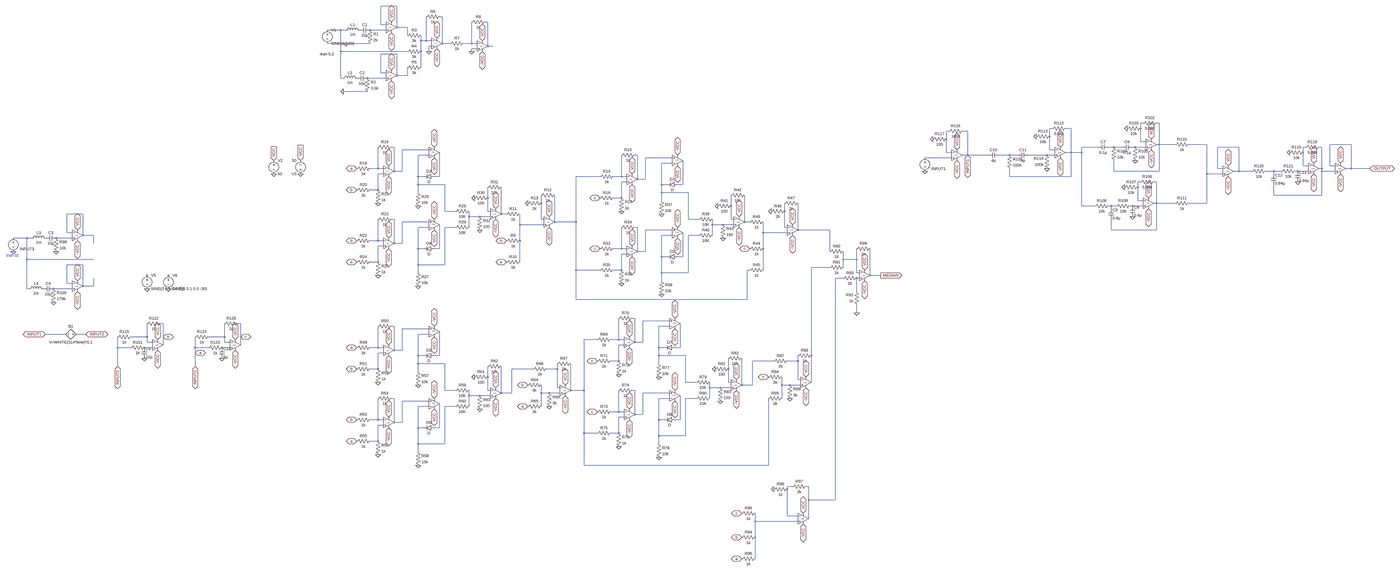
[diagram p0: schematic Median Filter.asc, whole sheet]
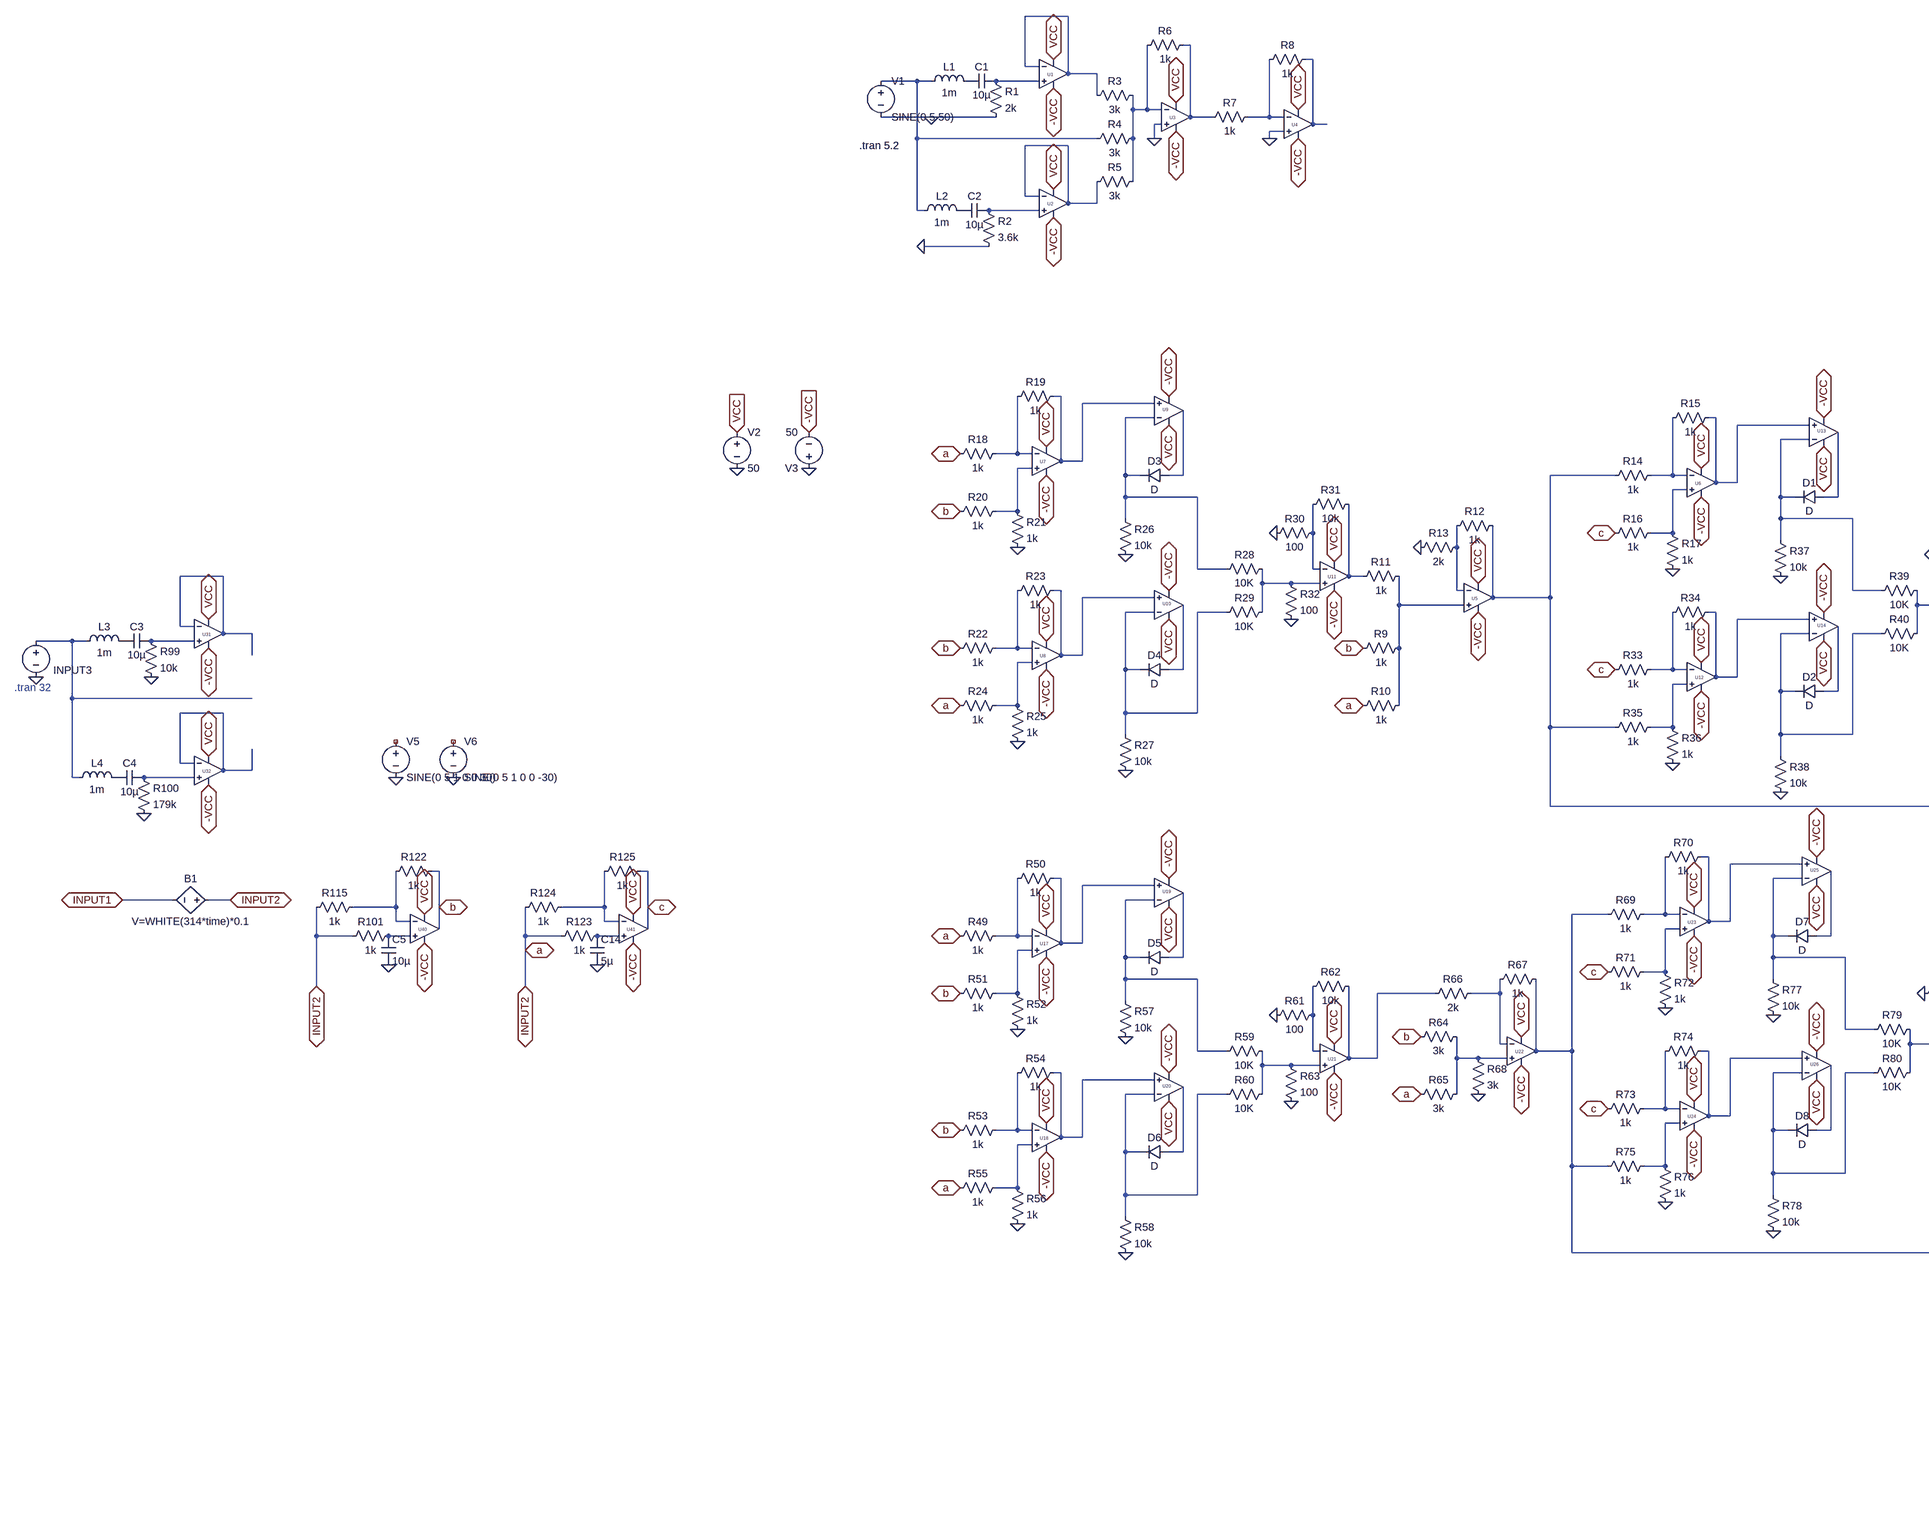
[diagram p1: schematic Median Filter.asc, part, row 1 of 1, column 1 of 2]
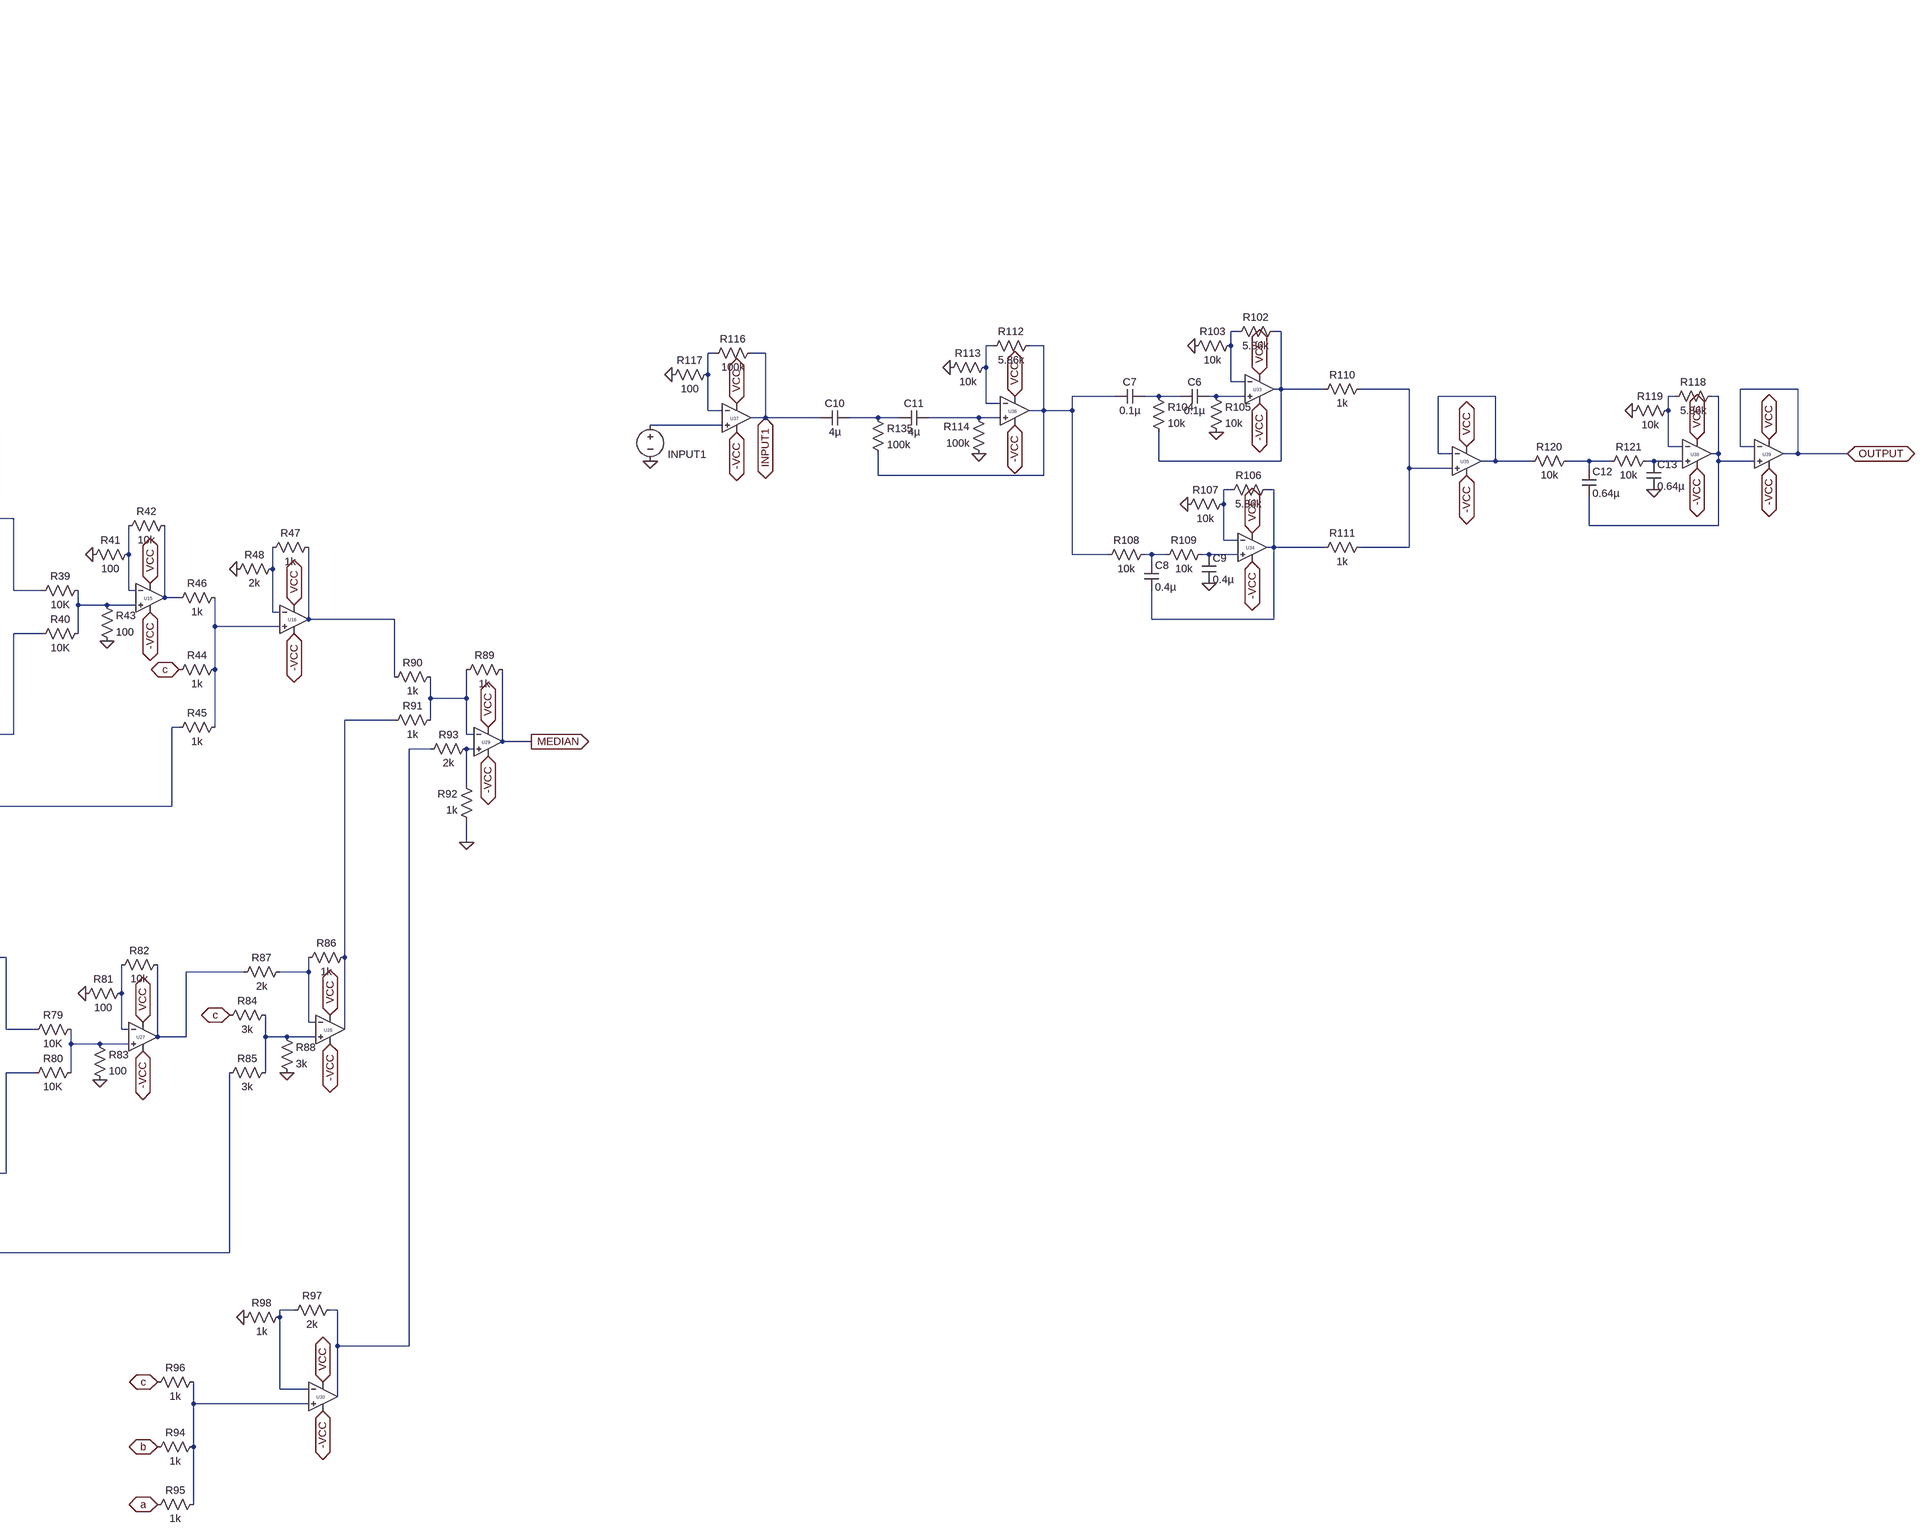
[diagram p2: schematic Median Filter.asc, part, row 1 of 1, column 2 of 2]
Median Filter.asc, the LTspice schematic file:
Version 4
SHEET 1 6620 3560
WIRE 464 -16 368 -16
WIRE 736 48 720 48
WIRE 1008 80 992 80
WIRE 368 96 368 -16
WIRE 400 96 368 96
WIRE 464 112 464 -16
WIRE 528 112 464 112
WIRE 128 128 48 128
WIRE 160 128 128 128
WIRE 400 128 304 128
WIRE 528 160 528 112
WIRE 608 192 608 160
WIRE 640 192 640 48
WIRE 640 192 608 192
WIRE 672 192 640 192
WIRE 160 208 48 208
WIRE 304 208 160 208
WIRE 736 208 736 48
WIRE 784 208 736 208
WIRE 912 208 912 80
WIRE 912 208 864 208
WIRE 944 208 912 208
WIRE 672 224 656 224
WIRE 1008 224 1008 80
WIRE 1040 224 1008 224
WIRE 944 240 912 240
WIRE 128 256 128 128
WIRE 528 256 128 256
WIRE 608 256 608 192
WIRE 656 256 656 224
WIRE 912 256 912 240
WIRE 464 272 368 272
WIRE 608 352 608 256
WIRE 368 384 368 272
WIRE 400 384 368 384
WIRE 464 400 464 272
WIRE 528 400 528 352
WIRE 528 400 464 400
WIRE 128 416 128 256
WIRE 144 416 128 416
WIRE 400 416 288 416
WIRE 288 496 144 496
WIRE 5040 880 5024 880
WIRE 5136 880 5120 880
WIRE 4496 912 4480 912
WIRE 4608 912 4576 912
WIRE 5024 912 5024 880
WIRE 3856 928 3840 928
WIRE 3968 928 3936 928
WIRE 4480 960 4480 912
WIRE 3840 976 3840 928
WIRE 5024 992 5024 912
WIRE 5056 992 5024 992
WIRE 5136 1008 5136 880
WIRE 5136 1008 5120 1008
WIRE 5232 1008 5136 1008
WIRE 5424 1008 5312 1008
WIRE 6288 1008 6160 1008
WIRE 448 1024 432 1024
WIRE 4768 1024 4672 1024
WIRE 4864 1024 4832 1024
WIRE 4912 1024 4864 1024
WIRE 4992 1024 4976 1024
WIRE 5056 1024 4992 1024
WIRE 5616 1024 5488 1024
WIRE 6016 1024 6000 1024
WIRE 6112 1024 6096 1024
WIRE 656 1040 496 1040
WIRE 4480 1040 4480 960
WIRE 4512 1040 4480 1040
WIRE 3840 1056 3840 976
WIRE 3872 1056 3840 1056
WIRE 4608 1056 4608 912
WIRE 4608 1056 4576 1056
WIRE 4672 1056 4672 1024
WIRE 4672 1056 4608 1056
WIRE 6000 1056 6000 1024
WIRE 656 1072 592 1072
WIRE 1904 1072 1888 1072
WIRE 3968 1072 3968 928
WIRE 3968 1072 3936 1072
WIRE 4112 1072 3968 1072
WIRE 4240 1072 4176 1072
WIRE 4288 1072 4240 1072
WIRE 4464 1072 4352 1072
WIRE 4512 1072 4464 1072
WIRE 2112 1088 1952 1088
WIRE 3872 1088 3712 1088
WIRE 2112 1120 2048 1120
WIRE 6000 1136 6000 1056
WIRE 6032 1136 6000 1136
WIRE 6160 1136 6160 1008
WIRE 6192 1136 6160 1136
WIRE 352 1152 352 1024
WIRE 352 1152 304 1152
WIRE 384 1152 352 1152
WIRE 5488 1152 5488 1024
WIRE 5520 1152 5488 1152
WIRE 6112 1152 6112 1024
WIRE 6112 1152 6096 1152
WIRE 6288 1152 6288 1008
WIRE 6288 1152 6256 1152
WIRE 6432 1152 6288 1152
WIRE 448 1168 448 1024
WIRE 496 1168 496 1040
WIRE 496 1168 448 1168
WIRE 4864 1168 4864 1104
WIRE 5136 1168 5136 1008
WIRE 5136 1168 4864 1168
WIRE 5616 1168 5616 1024
WIRE 5616 1168 5584 1168
WIRE 5696 1168 5616 1168
WIRE 5824 1168 5776 1168
WIRE 5872 1168 5824 1168
WIRE 5968 1168 5952 1168
WIRE 6032 1168 5968 1168
WIRE 6112 1168 6112 1152
WIRE 6192 1168 6112 1168
WIRE 384 1184 352 1184
WIRE 5424 1184 5424 1008
WIRE 5520 1184 5424 1184
WIRE 5824 1184 5824 1168
WIRE 592 1200 592 1072
WIRE 624 1200 592 1200
WIRE 720 1200 720 1056
WIRE 720 1200 688 1200
WIRE 1680 1200 1536 1200
WIRE 1808 1200 1808 1072
WIRE 1808 1200 1760 1200
WIRE 1840 1200 1808 1200
WIRE 4240 1200 4240 1152
WIRE 4608 1200 4608 1056
WIRE 4608 1200 4240 1200
WIRE 1904 1216 1904 1072
WIRE 1952 1216 1952 1088
WIRE 1952 1216 1904 1216
WIRE 1840 1232 1808 1232
WIRE 5024 1232 5008 1232
WIRE 5120 1232 5104 1232
WIRE 592 1248 592 1200
WIRE 752 1248 592 1248
WIRE 2048 1248 2048 1120
WIRE 2080 1248 2048 1248
WIRE 2176 1248 2176 1104
WIRE 2176 1248 2144 1248
WIRE 5008 1264 5008 1232
WIRE 352 1280 352 1184
WIRE 352 1280 304 1280
WIRE 592 1296 592 1248
WIRE 2048 1296 2048 1248
WIRE 2208 1296 2048 1296
WIRE 5824 1312 5824 1248
WIRE 6112 1312 6112 1168
WIRE 6112 1312 5824 1312
WIRE 1008 1328 1008 1264
WIRE 1808 1328 1808 1232
WIRE 1808 1328 1760 1328
WIRE 2048 1344 2048 1296
WIRE 5008 1344 5008 1264
WIRE 5040 1344 5008 1344
WIRE 1328 1360 1328 1312
WIRE 5120 1360 5120 1232
WIRE 5120 1360 5104 1360
WIRE 5232 1360 5120 1360
WIRE 5424 1360 5424 1184
WIRE 5424 1360 5312 1360
WIRE 2464 1376 2464 1312
WIRE 4672 1376 4672 1056
WIRE 4752 1376 4672 1376
WIRE 4848 1376 4832 1376
WIRE 4880 1376 4848 1376
WIRE 4976 1376 4960 1376
WIRE 5040 1376 4976 1376
WIRE 4848 1392 4848 1376
WIRE 752 1408 752 1248
WIRE 816 1408 752 1408
WIRE 1008 1408 1008 1328
WIRE 1024 1408 1008 1408
WIRE 2784 1408 2784 1360
WIRE -1616 1424 -1712 1424
WIRE 1088 1424 1088 1264
WIRE 1120 1424 1088 1424
WIRE 896 1440 896 1408
WIRE 960 1440 896 1440
WIRE 1024 1440 960 1440
WIRE 448 1456 432 1456
WIRE 1328 1456 1328 1360
WIRE 1344 1456 1328 1456
WIRE 2208 1456 2208 1296
WIRE 2272 1456 2208 1456
WIRE 2464 1456 2464 1376
WIRE 2480 1456 2464 1456
WIRE 656 1472 496 1472
WIRE 1408 1472 1408 1312
WIRE 1536 1472 1536 1200
WIRE 1536 1472 1408 1472
WIRE 2544 1472 2544 1312
WIRE 2576 1472 2544 1472
WIRE 1200 1488 1200 1424
WIRE 1344 1488 1200 1488
WIRE 2352 1488 2352 1456
WIRE 2416 1488 2352 1488
WIRE 2480 1488 2416 1488
WIRE 656 1504 592 1504
WIRE 816 1504 752 1504
WIRE 896 1504 896 1440
WIRE 1904 1504 1888 1504
WIRE 2784 1504 2784 1408
WIRE 2800 1504 2784 1504
WIRE 2112 1520 1952 1520
WIRE 2864 1520 2864 1360
WIRE 3072 1520 2864 1520
WIRE 4848 1520 4848 1456
WIRE 5120 1520 5120 1360
WIRE 5120 1520 4848 1520
WIRE -1712 1536 -1712 1424
WIRE -1680 1536 -1712 1536
WIRE 2656 1536 2656 1472
WIRE 2800 1536 2656 1536
WIRE -1616 1552 -1616 1424
WIRE -1552 1552 -1616 1552
WIRE 2112 1552 2048 1552
WIRE 2272 1552 2208 1552
WIRE 2352 1552 2352 1488
WIRE -1952 1568 -2032 1568
WIRE -1920 1568 -1952 1568
WIRE -1680 1568 -1776 1568
WIRE 352 1584 352 1456
WIRE 352 1584 304 1584
WIRE 384 1584 352 1584
WIRE 1200 1584 1200 1488
WIRE -1552 1600 -1552 1552
WIRE 448 1600 448 1456
WIRE 496 1600 496 1472
WIRE 496 1600 448 1600
WIRE 384 1616 352 1616
WIRE 592 1632 592 1504
WIRE 624 1632 592 1632
WIRE 720 1632 720 1488
WIRE 720 1632 688 1632
WIRE 1808 1632 1808 1504
WIRE 1808 1632 1760 1632
WIRE 1840 1632 1808 1632
WIRE 2656 1632 2656 1536
WIRE 1904 1648 1904 1504
WIRE 1952 1648 1952 1520
WIRE 1952 1648 1904 1648
WIRE 3072 1648 3072 1520
WIRE 1840 1664 1808 1664
WIRE 2048 1680 2048 1552
WIRE 2080 1680 2048 1680
WIRE 2176 1680 2176 1536
WIRE 2176 1680 2144 1680
WIRE -1952 1696 -1952 1568
WIRE -1552 1696 -1952 1696
WIRE 3152 1696 3152 1648
WIRE 3232 1696 3232 1632
WIRE 3232 1696 3152 1696
WIRE 352 1712 352 1616
WIRE 352 1712 304 1712
WIRE 1200 1712 1200 1584
WIRE -1616 1728 -1712 1728
WIRE 592 1728 592 1632
WIRE 752 1728 752 1504
WIRE 752 1728 592 1728
WIRE 3072 1744 2944 1744
WIRE 3152 1744 3152 1696
WIRE 1536 1760 1536 1472
WIRE 1680 1760 1536 1760
WIRE 1808 1760 1808 1664
WIRE 1808 1760 1760 1760
WIRE 2576 1760 2560 1760
WIRE 2656 1760 2656 1632
WIRE 592 1776 592 1728
WIRE 2048 1776 2048 1680
WIRE 2208 1776 2208 1552
WIRE 2208 1776 2048 1776
WIRE 3232 1776 3232 1696
WIRE 3248 1776 3232 1776
WIRE 3312 1792 3312 1632
WIRE 3376 1792 3312 1792
WIRE 3152 1808 3104 1808
WIRE 3248 1808 3232 1808
WIRE 2048 1824 2048 1776
WIRE -1712 1840 -1712 1728
WIRE -1680 1840 -1712 1840
WIRE -1616 1856 -1616 1728
WIRE -1552 1856 -1552 1808
WIRE -1552 1856 -1616 1856
WIRE -1952 1872 -1952 1696
WIRE -1936 1872 -1952 1872
WIRE -1680 1872 -1792 1872
WIRE 3232 1888 3232 1808
WIRE 1536 1936 1536 1760
WIRE 2560 1936 2560 1760
WIRE 2560 1936 1536 1936
WIRE 3232 2016 3232 1968
WIRE 1888 2048 1872 2048
WIRE 2096 2064 1936 2064
WIRE -1136 2080 -1152 2080
WIRE -672 2080 -688 2080
WIRE 448 2096 432 2096
WIRE 2096 2096 2032 2096
WIRE 656 2112 496 2112
WIRE -1728 2144 -1840 2144
WIRE -1600 2144 -1648 2144
WIRE 656 2144 592 2144
WIRE -1232 2160 -1232 2080
WIRE -1232 2160 -1328 2160
WIRE -1136 2160 -1136 2080
WIRE -768 2160 -768 2080
WIRE -768 2160 -864 2160
WIRE -672 2160 -672 2080
WIRE 1664 2176 1584 2176
WIRE 1792 2176 1792 2048
WIRE 1792 2176 1744 2176
WIRE 1824 2176 1792 2176
WIRE -1232 2192 -1232 2160
WIRE -1200 2192 -1232 2192
WIRE -768 2192 -768 2160
WIRE -736 2192 -768 2192
WIRE 1888 2192 1888 2048
WIRE 1936 2192 1936 2064
WIRE 1936 2192 1888 2192
WIRE -1136 2208 -1136 2160
WIRE -672 2208 -672 2160
WIRE 1824 2208 1792 2208
WIRE -1408 2224 -1408 2160
WIRE -1328 2224 -1408 2224
WIRE -1200 2224 -1248 2224
WIRE -944 2224 -944 2160
WIRE -864 2224 -944 2224
WIRE -736 2224 -784 2224
WIRE 352 2224 352 2096
WIRE 352 2224 304 2224
WIRE 384 2224 352 2224
WIRE 2032 2224 2032 2096
WIRE 2064 2224 2032 2224
WIRE 2160 2224 2160 2080
WIRE 2160 2224 2128 2224
WIRE 448 2240 448 2096
WIRE 496 2240 496 2112
WIRE 496 2240 448 2240
WIRE -944 2256 -944 2224
WIRE 384 2256 352 2256
WIRE 592 2272 592 2144
WIRE 624 2272 592 2272
WIRE 720 2272 720 2128
WIRE 720 2272 688 2272
WIRE 2032 2272 2032 2224
WIRE 2192 2272 2032 2272
WIRE 2944 2272 2944 1744
WIRE 1792 2304 1792 2208
WIRE 1792 2304 1744 2304
WIRE 2720 2304 2592 2304
WIRE 2864 2304 2864 2272
WIRE 2864 2304 2800 2304
WIRE 592 2320 592 2272
WIRE 752 2320 592 2320
WIRE 2032 2320 2032 2272
WIRE -1408 2336 -1408 2224
WIRE -944 2336 -944 2256
WIRE 352 2352 352 2256
WIRE 352 2352 304 2352
WIRE 1280 2352 1152 2352
WIRE 1424 2352 1424 2320
WIRE 1424 2352 1360 2352
WIRE 2448 2352 2448 2288
WIRE 592 2368 592 2320
WIRE 1008 2400 1008 2336
WIRE 2864 2416 2864 2304
WIRE 2880 2416 2864 2416
WIRE 2192 2432 2192 2272
WIRE 2256 2432 2192 2432
WIRE 2448 2432 2448 2352
WIRE 2464 2432 2448 2432
WIRE 2944 2432 2944 2272
WIRE 2528 2448 2528 2288
WIRE 2592 2448 2592 2304
WIRE 2592 2448 2528 2448
WIRE 2768 2448 2768 2400
WIRE 2816 2448 2768 2448
WIRE 2880 2448 2816 2448
WIRE 1424 2464 1424 2352
WIRE 1440 2464 1424 2464
WIRE 2336 2464 2336 2432
WIRE 2400 2464 2336 2464
WIRE 2464 2464 2400 2464
WIRE 752 2480 752 2320
WIRE 816 2480 752 2480
WIRE 1008 2480 1008 2400
WIRE 1024 2480 1008 2480
WIRE 1504 2480 1504 2320
WIRE 1584 2480 1584 2176
WIRE 1584 2480 1504 2480
WIRE 1888 2480 1872 2480
WIRE 1088 2496 1088 2336
WIRE 1152 2496 1152 2352
WIRE 1152 2496 1088 2496
WIRE 1328 2496 1328 2448
WIRE 1376 2496 1328 2496
WIRE 1440 2496 1376 2496
WIRE 2096 2496 1936 2496
WIRE 896 2512 896 2480
WIRE 960 2512 896 2512
WIRE 1024 2512 960 2512
WIRE 448 2528 432 2528
WIRE 2096 2528 2032 2528
WIRE 2256 2528 2192 2528
WIRE 2336 2528 2336 2464
WIRE 2768 2528 2768 2448
WIRE 656 2544 496 2544
WIRE 656 2576 592 2576
WIRE 816 2576 752 2576
WIRE 896 2576 896 2512
WIRE 1328 2576 1328 2496
WIRE 1792 2608 1792 2480
WIRE 1792 2608 1744 2608
WIRE 1824 2608 1792 2608
WIRE 1888 2624 1888 2480
WIRE 1936 2624 1936 2496
WIRE 1936 2624 1888 2624
WIRE 1824 2640 1792 2640
WIRE 352 2656 352 2528
WIRE 352 2656 304 2656
WIRE 384 2656 352 2656
WIRE 2032 2656 2032 2528
WIRE 2064 2656 2032 2656
WIRE 2160 2656 2160 2512
WIRE 2160 2656 2128 2656
WIRE 448 2672 448 2528
WIRE 496 2672 496 2544
WIRE 496 2672 448 2672
WIRE 384 2688 352 2688
WIRE 592 2704 592 2576
WIRE 624 2704 592 2704
WIRE 720 2704 720 2560
WIRE 720 2704 688 2704
WIRE 1584 2736 1584 2480
WIRE 1664 2736 1584 2736
WIRE 1792 2736 1792 2640
WIRE 1792 2736 1744 2736
WIRE 2032 2752 2032 2656
WIRE 2192 2752 2192 2528
WIRE 2192 2752 2032 2752
WIRE 352 2784 352 2688
WIRE 352 2784 304 2784
WIRE 592 2800 592 2704
WIRE 752 2800 752 2576
WIRE 752 2800 592 2800
WIRE 2032 2800 2032 2752
WIRE 592 2848 592 2800
WIRE 1584 2928 1584 2736
WIRE 2688 2928 2688 2528
WIRE 2688 2928 1584 2928
WIRE 2832 3056 2800 3056
WIRE 2928 3056 2912 3056
WIRE 2800 3072 2800 3056
WIRE 2928 3136 2928 3056
WIRE 3104 3136 3104 1808
WIRE 3104 3136 2928 3136
WIRE 2800 3232 2800 3072
WIRE 2864 3232 2800 3232
WIRE 2928 3248 2928 3136
WIRE 2608 3264 2608 3216
WIRE 2864 3264 2608 3264
WIRE 2608 3360 2608 3264
WIRE 2608 3488 2608 3360
FLAG 160 208 0
FLAG 144 496 0
FLAG 432 80 VCC
IOPIN 432 80 BiDir
FLAG 432 144 -VCC
IOPIN 432 144 BiDir
FLAG -272 1184 0
FLAG -112 1184 0
FLAG -272 1104 VCC
IOPIN -272 1104 In
FLAG -112 1104 -VCC
IOPIN -112 1104 In
FLAG 432 368 VCC
IOPIN 432 368 BiDir
FLAG 432 432 -VCC
IOPIN 432 432 BiDir
FLAG 704 176 VCC
IOPIN 704 176 BiDir
FLAG 704 240 -VCC
IOPIN 704 240 BiDir
FLAG 656 256 0
FLAG 976 192 VCC
IOPIN 976 192 BiDir
FLAG 976 256 -VCC
IOPIN 976 256 BiDir
FLAG 912 256 0
FLAG -1232 1872 0
FLAG 416 1136 VCC
IOPIN 416 1136 BiDir
FLAG 416 1200 -VCC
IOPIN 416 1200 BiDir
FLAG 352 1360 0
FLAG 416 1568 VCC
IOPIN 416 1568 BiDir
FLAG 416 1632 -VCC
IOPIN 416 1632 BiDir
FLAG 352 1792 0
FLAG 224 1152 a
IOPIN 224 1152 BiDir
FLAG 224 1712 a
IOPIN 224 1712 BiDir
FLAG 224 1280 b
IOPIN 224 1280 BiDir
FLAG 224 1584 b
IOPIN 224 1584 BiDir
FLAG 688 1088 VCC
IOPIN 688 1088 BiDir
FLAG 688 1024 -VCC
IOPIN 688 1024 BiDir
FLAG 592 1376 0
FLAG 688 1520 VCC
IOPIN 688 1520 BiDir
FLAG 688 1456 -VCC
IOPIN 688 1456 BiDir
FLAG 592 1856 0
FLAG 1056 1392 VCC
IOPIN 1056 1392 BiDir
FLAG 1056 1456 -VCC
IOPIN 1056 1456 BiDir
FLAG 928 1328 0
FLAG 960 1520 0
FLAG 1120 1712 a
IOPIN 1120 1712 BiDir
FLAG 1120 1584 b
IOPIN 1120 1584 BiDir
FLAG 1376 1440 VCC
IOPIN 1376 1440 BiDir
FLAG 1376 1504 -VCC
IOPIN 1376 1504 BiDir
FLAG 1248 1360 0
FLAG 1872 1184 VCC
IOPIN 1872 1184 BiDir
FLAG 1872 1248 -VCC
IOPIN 1872 1248 BiDir
FLAG 1808 1408 0
FLAG 1872 1616 VCC
IOPIN 1872 1616 BiDir
FLAG 1872 1680 -VCC
IOPIN 1872 1680 BiDir
FLAG 1808 1840 0
FLAG 1680 1328 c
IOPIN 1680 1328 BiDir
FLAG 1680 1632 c
IOPIN 1680 1632 BiDir
FLAG 2144 1136 VCC
IOPIN 2144 1136 BiDir
FLAG 2144 1072 -VCC
IOPIN 2144 1072 BiDir
FLAG 2048 1424 0
FLAG 2144 1568 VCC
IOPIN 2144 1568 BiDir
FLAG 2144 1504 -VCC
IOPIN 2144 1504 BiDir
FLAG 2048 1904 0
FLAG 2512 1440 VCC
IOPIN 2512 1440 BiDir
FLAG 2512 1504 -VCC
IOPIN 2512 1504 BiDir
FLAG 2384 1376 0
FLAG 2416 1568 0
FLAG 2576 1632 c
IOPIN 2576 1632 BiDir
FLAG 2832 1488 VCC
IOPIN 2832 1488 BiDir
FLAG 2832 1552 -VCC
IOPIN 2832 1552 BiDir
FLAG 2704 1408 0
FLAG 416 2208 VCC
IOPIN 416 2208 BiDir
FLAG 416 2272 -VCC
IOPIN 416 2272 BiDir
FLAG 352 2432 0
FLAG 416 2640 VCC
IOPIN 416 2640 BiDir
FLAG 416 2704 -VCC
IOPIN 416 2704 BiDir
FLAG 352 2864 0
FLAG 224 2224 a
IOPIN 224 2224 BiDir
FLAG 224 2784 a
IOPIN 224 2784 BiDir
FLAG 224 2352 b
IOPIN 224 2352 BiDir
FLAG 224 2656 b
IOPIN 224 2656 BiDir
FLAG 688 2160 VCC
IOPIN 688 2160 BiDir
FLAG 688 2096 -VCC
IOPIN 688 2096 BiDir
FLAG 592 2448 0
FLAG 688 2592 VCC
IOPIN 688 2592 BiDir
FLAG 688 2528 -VCC
IOPIN 688 2528 BiDir
FLAG 592 2928 0
FLAG 1056 2464 VCC
IOPIN 1056 2464 BiDir
FLAG 1056 2528 -VCC
IOPIN 1056 2528 BiDir
FLAG 928 2400 0
FLAG 960 2592 0
FLAG 1248 2576 a
IOPIN 1248 2576 BiDir
FLAG 1248 2448 b
IOPIN 1248 2448 BiDir
FLAG 1472 2448 VCC
IOPIN 1472 2448 BiDir
FLAG 1472 2512 -VCC
IOPIN 1472 2512 BiDir
FLAG 1376 2576 0
FLAG 1856 2160 VCC
IOPIN 1856 2160 BiDir
FLAG 1856 2224 -VCC
IOPIN 1856 2224 BiDir
FLAG 1792 2384 0
FLAG 1856 2592 VCC
IOPIN 1856 2592 BiDir
FLAG 1856 2656 -VCC
IOPIN 1856 2656 BiDir
FLAG 1792 2816 0
FLAG 1664 2304 c
IOPIN 1664 2304 BiDir
FLAG 1664 2608 c
IOPIN 1664 2608 BiDir
FLAG 2128 2112 VCC
IOPIN 2128 2112 BiDir
FLAG 2128 2048 -VCC
IOPIN 2128 2048 BiDir
FLAG 2032 2400 0
FLAG 2128 2544 VCC
IOPIN 2128 2544 BiDir
FLAG 2128 2480 -VCC
IOPIN 2128 2480 BiDir
FLAG 2032 2880 0
FLAG 2496 2416 VCC
IOPIN 2496 2416 BiDir
FLAG 2496 2480 -VCC
IOPIN 2496 2480 BiDir
FLAG 2368 2352 0
FLAG 2400 2544 0
FLAG 2688 2400 c
IOPIN 2688 2400 BiDir
FLAG 2912 2400 VCC
IOPIN 2912 2400 BiDir
FLAG 2912 2464 -VCC
IOPIN 2912 2464 BiDir
FLAG 2816 2528 0
FLAG -1104 1872 0
FLAG 3280 1760 VCC
IOPIN 3280 1760 BiDir
FLAG 3280 1824 -VCC
IOPIN 3280 1824 BiDir
FLAG 2896 3216 VCC
IOPIN 2896 3216 BiDir
FLAG 2896 3280 -VCC
IOPIN 2896 3280 BiDir
FLAG 2528 3488 a
IOPIN 2528 3488 BiDir
FLAG 2528 3360 b
IOPIN 2528 3360 BiDir
FLAG 2528 3216 c
IOPIN 2528 3216 BiDir
FLAG 2720 3072 0
FLAG 3232 2016 0
FLAG -1792 1952 0
FLAG -1648 1520 VCC
IOPIN -1648 1520 BiDir
FLAG -1648 1584 -VCC
IOPIN -1648 1584 BiDir
FLAG -1648 1824 VCC
IOPIN -1648 1824 BiDir
FLAG -1648 1888 -VCC
IOPIN -1648 1888 BiDir
FLAG -1776 1648 0
FLAG 3376 1792 MEDIAN
IOPIN 3376 1792 Out
FLAG 5088 976 VCC
IOPIN 5088 976 BiDir
FLAG 5088 1040 -VCC
IOPIN 5088 1040 BiDir
FLAG 4944 912 0
FLAG 4992 1104 0
FLAG 5072 1328 VCC
IOPIN 5072 1328 BiDir
FLAG 5072 1392 -VCC
IOPIN 5072 1392 BiDir
FLAG 4928 1264 0
FLAG 4976 1440 0
FLAG 5552 1136 VCC
IOPIN 5552 1136 BiDir
FLAG 5552 1200 -VCC
IOPIN 5552 1200 BiDir
FLAG 4544 1024 VCC
IOPIN 4544 1024 BiDir
FLAG 4544 1088 -VCC
IOPIN 4544 1088 BiDir
FLAG 4400 960 0
FLAG 4464 1152 0
FLAG 3904 1040 VCC
IOPIN 3904 1040 BiDir
FLAG 3904 1104 -VCC
IOPIN 3904 1104 BiDir
FLAG 3760 976 0
FLAG 3712 1168 0
FLAG 6064 1120 VCC
IOPIN 6064 1120 BiDir
FLAG 6064 1184 -VCC
IOPIN 6064 1184 BiDir
FLAG 5920 1056 0
FLAG 5968 1232 0
FLAG 6432 1152 OUTPUT
IOPIN 6432 1152 BiDir
FLAG 6224 1120 VCC
IOPIN 6224 1120 BiDir
FLAG 6224 1184 -VCC
IOPIN 6224 1184 BiDir
FLAG 3968 1072 INPUT1
IOPIN 3968 1072 BiDir
FLAG -1840 2144 INPUT1
IOPIN -1840 2144 BiDir
FLAG -2032 1648 0
FLAG -1168 2176 VCC
IOPIN -1168 2176 BiDir
FLAG -1168 2240 -VCC
IOPIN -1168 2240 BiDir
FLAG -1248 2288 0
FLAG -704 2176 VCC
IOPIN -704 2176 BiDir
FLAG -704 2240 -VCC
IOPIN -704 2240 BiDir
FLAG -784 2288 0
FLAG -944 2256 a
IOPIN -944 2256 BiDir
FLAG -1136 2160 b
IOPIN -1136 2160 BiDir
FLAG -672 2160 c
IOPIN -672 2160 BiDir
FLAG -1600 2144 INPUT2
IOPIN -1600 2144 BiDir
FLAG -1408 2336 INPUT2
IOPIN -1408 2336 BiDir
FLAG -944 2336 INPUT2
IOPIN -944 2336 BiDir
SYMBOL voltage 48 112 R0
WINDOW 123 0 0 Left 0
WINDOW 39 0 0 Left 0
SYMATTR InstName V1
SYMATTR Value SINE(0 5 50)
SYMBOL ind 144 144 R270
WINDOW 0 32 56 VTop 2
WINDOW 3 5 56 VBottom 2
SYMATTR InstName L1
SYMATTR Value 1m
SYMBOL cap 304 112 R90
WINDOW 0 0 32 VBottom 2
WINDOW 3 32 32 VTop 2
SYMATTR InstName C1
SYMATTR Value 10µ
SYMBOL res 288 112 R0
SYMATTR InstName R1
SYMATTR Value 2k
SYMBOL ind 128 432 R270
WINDOW 0 32 56 VTop 2
WINDOW 3 5 56 VBottom 2
SYMATTR InstName L2
SYMATTR Value 1m
SYMBOL cap 288 400 R90
WINDOW 0 0 32 VBottom 2
WINDOW 3 32 32 VTop 2
SYMATTR InstName C2
SYMATTR Value 10µ
SYMBOL res 272 400 R0
SYMATTR InstName R2
SYMATTR Value 3.6k
SYMBOL OpAmps\\UniversalOpAmp2 432 112 R0
WINDOW 0 -14 2 Left 0
SYMATTR InstName U1
SYMBOL voltage -272 1088 R0
WINDOW 123 0 0 Left 0
WINDOW 39 0 0 Left 0
SYMATTR InstName V2
SYMATTR Value 50
SYMBOL voltage -112 1200 R180
WINDOW 123 0 0 Left 0
WINDOW 39 0 0 Left 0
SYMATTR InstName V3
SYMATTR Value 50
SYMBOL OpAmps\\UniversalOpAmp2 432 400 R0
WINDOW 0 -14 2 Left 0
SYMATTR InstName U2
SYMBOL OpAmps\\UniversalOpAmp2 704 208 R0
WINDOW 0 -14 2 Left 0
SYMATTR InstName U3
SYMBOL res 624 144 R90
WINDOW 0 0 56 VBottom 2
WINDOW 3 32 56 VTop 2
SYMATTR InstName R3
SYMATTR Value 3k
SYMBOL res 624 240 R90
WINDOW 0 0 56 VBottom 2
WINDOW 3 32 56 VTop 2
SYMATTR InstName R4
SYMATTR Value 3k
SYMBOL res 624 336 R90
WINDOW 0 0 56 VBottom 2
WINDOW 3 32 56 VTop 2
SYMATTR InstName R5
SYMATTR Value 3k
SYMBOL res 736 32 R90
WINDOW 0 0 56 VBottom 2
WINDOW 3 32 56 VTop 2
SYMATTR InstName R6
SYMATTR Value 1k
SYMBOL OpAmps\\UniversalOpAmp2 976 224 R0
WINDOW 0 -14 2 Left 0
SYMATTR InstName U4
SYMBOL res 880 192 R90
WINDOW 0 0 56 VBottom 2
WINDOW 3 32 56 VTop 2
SYMATTR InstName R7
SYMATTR Value 1k
SYMBOL res 1008 64 R90
WINDOW 0 0 56 VBottom 2
WINDOW 3 32 56 VTop 2
SYMATTR InstName R8
SYMATTR Value 1k
SYMBOL voltage -1232 1776 R0
WINDOW 123 0 0 Left 0
WINDOW 39 0 0 Left 0
SYMATTR InstName V5
SYMATTR Value SINE(0 5 1 0 0 30)
SYMBOL OpAmps\\UniversalOpAmp2 416 1168 R0
WINDOW 0 -14 2 Left 0
SYMATTR InstName U7
SYMBOL res 320 1136 R90
WINDOW 0 0 56 VBottom 2
WINDOW 3 32 56 VTop 2
SYMATTR InstName R18
SYMATTR Value 1k
SYMBOL res 448 1008 R90
WINDOW 0 0 56 VBottom 2
WINDOW 3 32 56 VTop 2
SYMATTR InstName R19
SYMATTR Value 1k
SYMBOL res 320 1264 R90
WINDOW 0 0 56 VBottom 2
WINDOW 3 32 56 VTop 2
SYMATTR InstName R20
SYMATTR Value 1k
SYMBOL res 336 1264 R0
SYMATTR InstName R21
SYMATTR Value 1k
SYMBOL OpAmps\\UniversalOpAmp2 416 1600 R0
WINDOW 0 -14 2 Left 0
SYMATTR InstName U8
SYMBOL res 320 1568 R90
WINDOW 0 0 56 VBottom 2
WINDOW 3 32 56 VTop 2
SYMATTR InstName R22
SYMATTR Value 1k
SYMBOL res 448 1440 R90
WINDOW 0 0 56 VBottom 2
WINDOW 3 32 56 VTop 2
SYMATTR InstName R23
SYMATTR Value 1k
SYMBOL res 320 1696 R90
WINDOW 0 0 56 VBottom 2
WINDOW 3 32 56 VTop 2
SYMATTR InstName R24
SYMATTR Value 1k
SYMBOL res 336 1696 R0
SYMATTR InstName R25
SYMATTR Value 1k
SYMBOL OpAmps\\UniversalOpAmp2 688 1056 M180
WINDOW 0 -14 2 Left 0
SYMATTR InstName U9
SYMBOL res 576 1280 R0
SYMATTR InstName R26
SYMATTR Value 10k
SYMBOL diode 688 1184 R90
WINDOW 0 0 32 VBottom 2
WINDOW 3 32 32 VTop 2
SYMATTR InstName D3
SYMBOL OpAmps\\UniversalOpAmp2 688 1488 M180
WINDOW 0 -14 2 Left 0
SYMATTR InstName U10
SYMBOL res 576 1760 R0
SYMATTR InstName R27
SYMATTR Value 10k
SYMBOL diode 688 1616 R90
WINDOW 0 0 32 VBottom 2
WINDOW 3 32 32 VTop 2
SYMATTR InstName D4
SYMBOL res 912 1392 R90
WINDOW 0 0 56 VBottom 2
WINDOW 3 32 56 VTop 2
SYMATTR InstName R28
SYMATTR Value 10K
SYMBOL res 912 1488 R90
WINDOW 0 0 56 VBottom 2
WINDOW 3 32 56 VTop 2
SYMATTR InstName R29
SYMATTR Value 10K
SYMBOL OpAmps\\UniversalOpAmp2 1056 1424 R0
WINDOW 0 -14 2 Left 0
SYMATTR InstName U11
SYMBOL res 1024 1312 R90
WINDOW 0 0 56 VBottom 2
WINDOW 3 32 56 VTop 2
SYMATTR InstName R30
SYMATTR Value 100
SYMBOL res 1104 1248 R90
WINDOW 0 0 56 VBottom 2
WINDOW 3 32 56 VTop 2
SYMATTR InstName R31
SYMATTR Value 10k
SYMBOL res 944 1424 R0
SYMATTR InstName R32
SYMATTR Value 100
SYMBOL res 1216 1568 R90
WINDOW 0 0 56 VBottom 2
WINDOW 3 32 56 VTop 2
SYMATTR InstName R9
SYMATTR Value 1k
SYMBOL res 1216 1696 R90
WINDOW 0 0 56 VBottom 2
WINDOW 3 32 56 VTop 2
SYMATTR InstName R10
SYMATTR Value 1k
SYMBOL res 1216 1408 R90
WINDOW 0 0 56 VBottom 2
WINDOW 3 32 56 VTop 2
SYMATTR InstName R11
SYMATTR Value 1k
SYMBOL OpAmps\\UniversalOpAmp2 1376 1472 R0
WINDOW 0 -14 2 Left 0
SYMATTR InstName U5
SYMBOL res 1424 1296 R90
WINDOW 0 0 56 VBottom 2
WINDOW 3 32 56 VTop 2
SYMATTR InstName R12
SYMATTR Value 1k
SYMBOL res 1344 1344 R90
WINDOW 0 0 56 VBottom 2
WINDOW 3 32 56 VTop 2
SYMATTR InstName R13
SYMATTR Value 2k
SYMBOL OpAmps\\UniversalOpAmp2 1872 1216 R0
WINDOW 0 -14 2 Left 0
SYMATTR InstName U6
SYMBOL res 1776 1184 R90
WINDOW 0 0 56 VBottom 2
WINDOW 3 32 56 VTop 2
SYMATTR InstName R14
SYMATTR Value 1k
SYMBOL res 1904 1056 R90
WINDOW 0 0 56 VBottom 2
WINDOW 3 32 56 VTop 2
SYMATTR InstName R15
SYMATTR Value 1k
SYMBOL res 1776 1312 R90
WINDOW 0 0 56 VBottom 2
WINDOW 3 32 56 VTop 2
SYMATTR InstName R16
SYMATTR Value 1k
SYMBOL res 1792 1312 R0
SYMATTR InstName R17
SYMATTR Value 1k
SYMBOL OpAmps\\UniversalOpAmp2 1872 1648 R0
WINDOW 0 -14 2 Left 0
SYMATTR InstName U12
SYMBOL res 1776 1616 R90
WINDOW 0 0 56 VBottom 2
WINDOW 3 32 56 VTop 2
SYMATTR InstName R33
SYMATTR Value 1k
SYMBOL res 1904 1488 R90
WINDOW 0 0 56 VBottom 2
WINDOW 3 32 56 VTop 2
SYMATTR InstName R34
SYMATTR Value 1k
SYMBOL res 1776 1744 R90
WINDOW 0 0 56 VBottom 2
WINDOW 3 32 56 VTop 2
SYMATTR InstName R35
SYMATTR Value 1k
SYMBOL res 1792 1744 R0
SYMATTR InstName R36
SYMATTR Value 1k
SYMBOL OpAmps\\UniversalOpAmp2 2144 1104 M180
WINDOW 0 -14 2 Left 0
SYMATTR InstName U13
SYMBOL res 2032 1328 R0
SYMATTR InstName R37
SYMATTR Value 10k
SYMBOL diode 2144 1232 R90
WINDOW 0 0 32 VBottom 2
WINDOW 3 32 32 VTop 2
SYMATTR InstName D1
SYMBOL OpAmps\\UniversalOpAmp2 2144 1536 M180
WINDOW 0 -14 2 Left 0
SYMATTR InstName U14
SYMBOL res 2032 1808 R0
SYMATTR InstName R38
SYMATTR Value 10k
SYMBOL diode 2144 1664 R90
WINDOW 0 0 32 VBottom 2
WINDOW 3 32 32 VTop 2
SYMATTR InstName D2
SYMBOL res 2368 1440 R90
WINDOW 0 0 56 VBottom 2
WINDOW 3 32 56 VTop 2
SYMATTR InstName R39
SYMATTR Value 10K
SYMBOL res 2368 1536 R90
WINDOW 0 0 56 VBottom 2
WINDOW 3 32 56 VTop 2
SYMATTR InstName R40
SYMATTR Value 10K
SYMBOL OpAmps\\UniversalOpAmp2 2512 1472 R0
WINDOW 0 -14 2 Left 0
SYMATTR InstName U15
SYMBOL res 2480 1360 R90
WINDOW 0 0 56 VBottom 2
WINDOW 3 32 56 VTop 2
SYMATTR InstName R41
SYMATTR Value 100
SYMBOL res 2560 1296 R90
WINDOW 0 0 56 VBottom 2
WINDOW 3 32 56 VTop 2
SYMATTR InstName R42
SYMATTR Value 10k
SYMBOL res 2400 1472 R0
SYMATTR InstName R43
SYMATTR Value 100
SYMBOL res 2672 1616 R90
WINDOW 0 0 56 VBottom 2
WINDOW 3 32 56 VTop 2
SYMATTR InstName R44
SYMATTR Value 1k
SYMBOL res 2672 1744 R90
WINDOW 0 0 56 VBottom 2
WINDOW 3 32 56 VTop 2
SYMATTR InstName R45
SYMATTR Value 1k
SYMBOL res 2672 1456 R90
WINDOW 0 0 56 VBottom 2
WINDOW 3 32 56 VTop 2
SYMATTR InstName R46
SYMATTR Value 1k
SYMBOL OpAmps\\UniversalOpAmp2 2832 1520 R0
WINDOW 0 -14 2 Left 0
SYMATTR InstName U16
SYMBOL res 2880 1344 R90
WINDOW 0 0 56 VBottom 2
WINDOW 3 32 56 VTop 2
SYMATTR InstName R47
SYMATTR Value 1k
SYMBOL res 2800 1392 R90
WINDOW 0 0 56 VBottom 2
WINDOW 3 32 56 VTop 2
SYMATTR InstName R48
SYMATTR Value 2k
SYMBOL OpAmps\\UniversalOpAmp2 416 2240 R0
WINDOW 0 -14 2 Left 0
SYMATTR InstName U17
SYMBOL res 320 2208 R90
WINDOW 0 0 56 VBottom 2
WINDOW 3 32 56 VTop 2
SYMATTR InstName R49
SYMATTR Value 1k
SYMBOL res 448 2080 R90
WINDOW 0 0 56 VBottom 2
WINDOW 3 32 56 VTop 2
SYMATTR InstName R50
SYMATTR Value 1k
SYMBOL res 320 2336 R90
WINDOW 0 0 56 VBottom 2
WINDOW 3 32 56 VTop 2
SYMATTR InstName R51
SYMATTR Value 1k
SYMBOL res 336 2336 R0
SYMATTR InstName R52
SYMATTR Value 1k
SYMBOL OpAmps\\UniversalOpAmp2 416 2672 R0
WINDOW 0 -14 2 Left 0
SYMATTR InstName U18
SYMBOL res 320 2640 R90
WINDOW 0 0 56 VBottom 2
WINDOW 3 32 56 VTop 2
SYMATTR InstName R53
SYMATTR Value 1k
SYMBOL res 448 2512 R90
WINDOW 0 0 56 VBottom 2
WINDOW 3 32 56 VTop 2
SYMATTR InstName R54
SYMATTR Value 1k
SYMBOL res 320 2768 R90
WINDOW 0 0 56 VBottom 2
WINDOW 3 32 56 VTop 2
SYMATTR InstName R55
SYMATTR Value 1k
SYMBOL res 336 2768 R0
SYMATTR InstName R56
SYMATTR Value 1k
SYMBOL OpAmps\\UniversalOpAmp2 688 2128 M180
WINDOW 0 -14 2 Left 0
SYMATTR InstName U19
SYMBOL res 576 2352 R0
SYMATTR InstName R57
SYMATTR Value 10k
SYMBOL diode 688 2256 R90
WINDOW 0 0 32 VBottom 2
WINDOW 3 32 32 VTop 2
SYMATTR InstName D5
SYMBOL OpAmps\\UniversalOpAmp2 688 2560 M180
WINDOW 0 -14 2 Left 0
SYMATTR InstName U20
SYMBOL res 576 2832 R0
SYMATTR InstName R58
SYMATTR Value 10k
SYMBOL diode 688 2688 R90
WINDOW 0 0 32 VBottom 2
WINDOW 3 32 32 VTop 2
SYMATTR InstName D6
SYMBOL res 912 2464 R90
WINDOW 0 0 56 VBottom 2
WINDOW 3 32 56 VTop 2
SYMATTR InstName R59
SYMATTR Value 10K
SYMBOL res 912 2560 R90
WINDOW 0 0 56 VBottom 2
WINDOW 3 32 56 VTop 2
SYMATTR InstName R60
SYMATTR Value 10K
SYMBOL OpAmps\\UniversalOpAmp2 1056 2496 R0
WINDOW 0 -14 2 Left 0
SYMATTR InstName U21
SYMBOL res 1024 2384 R90
WINDOW 0 0 56 VBottom 2
WINDOW 3 32 56 VTop 2
SYMATTR InstName R61
SYMATTR Value 100
SYMBOL res 1104 2320 R90
WINDOW 0 0 56 VBottom 2
WINDOW 3 32 56 VTop 2
SYMATTR InstName R62
SYMATTR Value 10k
SYMBOL res 944 2496 R0
SYMATTR InstName R63
SYMATTR Value 100
SYMBOL res 1344 2432 R90
WINDOW 0 0 56 VBottom 2
WINDOW 3 32 56 VTop 2
SYMATTR InstName R64
SYMATTR Value 3k
SYMBOL res 1344 2560 R90
WINDOW 0 0 56 VBottom 2
WINDOW 3 32 56 VTop 2
SYMATTR InstName R65
SYMATTR Value 3k
SYMBOL OpAmps\\UniversalOpAmp2 1472 2480 R0
WINDOW 0 -14 2 Left 0
SYMATTR InstName U22
SYMBOL res 1520 2304 R90
WINDOW 0 0 56 VBottom 2
WINDOW 3 32 56 VTop 2
SYMATTR InstName R67
SYMATTR Value 1k
SYMBOL res 1376 2336 R90
WINDOW 0 0 56 VBottom 2
WINDOW 3 32 56 VTop 2
SYMATTR InstName R66
SYMATTR Value 2k
SYMBOL res 1360 2480 R0
SYMATTR InstName R68
SYMATTR Value 3k
SYMBOL OpAmps\\UniversalOpAmp2 1856 2192 R0
WINDOW 0 -14 2 Left 0
SYMATTR InstName U23
SYMBOL res 1760 2160 R90
WINDOW 0 0 56 VBottom 2
WINDOW 3 32 56 VTop 2
SYMATTR InstName R69
SYMATTR Value 1k
SYMBOL res 1888 2032 R90
WINDOW 0 0 56 VBottom 2
WINDOW 3 32 56 VTop 2
SYMATTR InstName R70
SYMATTR Value 1k
SYMBOL res 1760 2288 R90
WINDOW 0 0 56 VBottom 2
WINDOW 3 32 56 VTop 2
SYMATTR InstName R71
SYMATTR Value 1k
SYMBOL res 1776 2288 R0
SYMATTR InstName R72
SYMATTR Value 1k
SYMBOL OpAmps\\UniversalOpAmp2 1856 2624 R0
WINDOW 0 -14 2 Left 0
SYMATTR InstName U24
SYMBOL res 1760 2592 R90
WINDOW 0 0 56 VBottom 2
WINDOW 3 32 56 VTop 2
SYMATTR InstName R73
SYMATTR Value 1k
SYMBOL res 1888 2464 R90
WINDOW 0 0 56 VBottom 2
WINDOW 3 32 56 VTop 2
SYMATTR InstName R74
SYMATTR Value 1k
SYMBOL res 1760 2720 R90
WINDOW 0 0 56 VBottom 2
WINDOW 3 32 56 VTop 2
SYMATTR InstName R75
SYMATTR Value 1k
SYMBOL res 1776 2720 R0
SYMATTR InstName R76
SYMATTR Value 1k
SYMBOL OpAmps\\UniversalOpAmp2 2128 2080 M180
WINDOW 0 -14 2 Left 0
SYMATTR InstName U25
SYMBOL res 2016 2304 R0
SYMATTR InstName R77
SYMATTR Value 10k
SYMBOL diode 2128 2208 R90
WINDOW 0 0 32 VBottom 2
WINDOW 3 32 32 VTop 2
SYMATTR InstName D7
SYMBOL OpAmps\\UniversalOpAmp2 2128 2512 M180
WINDOW 0 -14 2 Left 0
SYMATTR InstName U26
SYMBOL res 2016 2784 R0
SYMATTR InstName R78
SYMATTR Value 10k
SYMBOL diode 2128 2640 R90
WINDOW 0 0 32 VBottom 2
WINDOW 3 32 32 VTop 2
SYMATTR InstName D8
SYMBOL res 2352 2416 R90
WINDOW 0 0 56 VBottom 2
WINDOW 3 32 56 VTop 2
SYMATTR InstName R79
SYMATTR Value 10K
SYMBOL res 2352 2512 R90
WINDOW 0 0 56 VBottom 2
WINDOW 3 32 56 VTop 2
SYMATTR InstName R80
SYMATTR Value 10K
SYMBOL OpAmps\\UniversalOpAmp2 2496 2448 R0
WINDOW 0 -14 2 Left 0
SYMATTR InstName U27
SYMBOL res 2464 2336 R90
WINDOW 0 0 56 VBottom 2
WINDOW 3 32 56 VTop 2
SYMATTR InstName R81
SYMATTR Value 100
SYMBOL res 2544 2272 R90
WINDOW 0 0 56 VBottom 2
WINDOW 3 32 56 VTop 2
SYMATTR InstName R82
SYMATTR Value 10k
SYMBOL res 2384 2448 R0
SYMATTR InstName R83
SYMATTR Value 100
SYMBOL res 2784 2384 R90
WINDOW 0 0 56 VBottom 2
WINDOW 3 32 56 VTop 2
SYMATTR InstName R84
SYMATTR Value 3k
SYMBOL res 2784 2512 R90
WINDOW 0 0 56 VBottom 2
WINDOW 3 32 56 VTop 2
SYMATTR InstName R85
SYMATTR Value 3k
SYMBOL OpAmps\\UniversalOpAmp2 2912 2432 R0
WINDOW 0 -14 2 Left 0
SYMATTR InstName U28
SYMBOL res 2960 2256 R90
WINDOW 0 0 56 VBottom 2
WINDOW 3 32 56 VTop 2
SYMATTR InstName R86
SYMATTR Value 1k
SYMBOL res 2816 2288 R90
WINDOW 0 0 56 VBottom 2
WINDOW 3 32 56 VTop 2
SYMATTR InstName R87
SYMATTR Value 2k
SYMBOL res 2800 2432 R0
SYMATTR InstName R88
SYMATTR Value 3k
SYMBOL voltage -1104 1776 R0
WINDOW 123 0 0 Left 0
WINDOW 39 0 0 Left 0
SYMATTR InstName V6
SYMATTR Value SINE(0 5 1 0 0 -30)
SYMBOL OpAmps\\UniversalOpAmp2 3280 1792 R0
WINDOW 0 -14 2 Left 0
SYMATTR InstName U29
SYMBOL res 3328 1616 R90
WINDOW 0 0 56 VBottom 2
WINDOW 3 32 56 VTop 2
SYMATTR InstName R89
SYMATTR Value 1k
SYMBOL res 3168 1632 R90
WINDOW 0 0 56 VBottom 2
WINDOW 3 32 56 VTop 2
SYMATTR InstName R90
SYMATTR Value 1k
SYMBOL res 3168 1728 R90
WINDOW 0 0 56 VBottom 2
WINDOW 3 32 56 VTop 2
SYMATTR InstName R91
SYMATTR Value 1k
SYMBOL res 3248 1984 R180
WINDOW 0 36 76 Left 2
WINDOW 3 36 40 Left 2
SYMATTR InstName R92
SYMATTR Value 1k
SYMBOL res 3248 1792 R90
WINDOW 0 0 56 VBottom 2
WINDOW 3 32 56 VTop 2
SYMATTR InstName R93
SYMATTR Value 2k
SYMBOL OpAmps\\UniversalOpAmp2 2896 3248 R0
WINDOW 0 -14 2 Left 0
SYMATTR InstName U30
SYMBOL res 2624 3344 R90
WINDOW 0 0 56 VBottom 2
WINDOW 3 32 56 VTop 2
SYMATTR InstName R94
SYMATTR Value 1k
SYMBOL res 2624 3472 R90
WINDOW 0 0 56 VBottom 2
WINDOW 3 32 56 VTop 2
SYMATTR InstName R95
SYMATTR Value 1k
SYMBOL res 2624 3200 R90
WINDOW 0 0 56 VBottom 2
WINDOW 3 32 56 VTop 2
SYMATTR InstName R96
SYMATTR Value 1k
SYMBOL res 2928 3040 R90
WINDOW 0 0 56 VBottom 2
WINDOW 3 32 56 VTop 2
SYMATTR InstName R97
SYMATTR Value 2k
SYMBOL res 2816 3056 R90
WINDOW 0 0 56 VBottom 2
WINDOW 3 32 56 VTop 2
SYMATTR InstName R98
SYMATTR Value 1k
SYMBOL ind -1936 1584 R270
WINDOW 0 32 56 VTop 2
WINDOW 3 5 56 VBottom 2
SYMATTR InstName L3
SYMATTR Value 1m
SYMBOL cap -1776 1552 R90
WINDOW 0 0 32 VBottom 2
WINDOW 3 32 32 VTop 2
SYMATTR InstName C3
SYMATTR Value 10µ
SYMBOL res -1792 1552 R0
SYMATTR InstName R99
SYMATTR Value 10k
SYMBOL ind -1952 1888 R270
WINDOW 0 32 56 VTop 2
WINDOW 3 5 56 VBottom 2
SYMATTR InstName L4
SYMATTR Value 1m
SYMBOL cap -1792 1856 R90
WINDOW 0 0 32 VBottom 2
WINDOW 3 32 32 VTop 2
SYMATTR InstName C4
SYMATTR Value 10µ
SYMBOL res -1808 1856 R0
SYMATTR InstName R100
SYMATTR Value 179k
SYMBOL OpAmps\\UniversalOpAmp2 -1648 1552 R0
WINDOW 0 -14 2 Left 0
SYMATTR InstName U31
SYMBOL OpAmps\\UniversalOpAmp2 -1648 1856 R0
WINDOW 0 -14 2 Left 0
SYMATTR InstName U32
SYMBOL OpAmps\\UniversalOpAmp2 5088 1008 R0
WINDOW 0 -14 2 Left 0
SYMATTR InstName U33
SYMBOL res 5024 896 R270
WINDOW 0 32 56 VTop 2
WINDOW 3 0 56 VBottom 2
SYMATTR InstName R102
SYMATTR Value 5.86k
SYMBOL res 4928 928 R270
WINDOW 0 32 56 VTop 2
WINDOW 3 0 56 VBottom 2
SYMATTR InstName R103
SYMATTR Value 10k
SYMBOL res 4848 1008 R0
SYMATTR InstName R104
SYMATTR Value 10k
SYMBOL res 4976 1008 R0
SYMATTR InstName R105
SYMATTR Value 10k
SYMBOL cap 4976 1008 R90
WINDOW 0 0 32 VBottom 2
WINDOW 3 32 32 VTop 2
SYMATTR InstName C6
SYMATTR Value 0.1µ
SYMBOL cap 4832 1008 R90
WINDOW 0 0 32 VBottom 2
WINDOW 3 32 32 VTop 2
SYMATTR InstName C7
SYMATTR Value 0.1µ
SYMBOL OpAmps\\UniversalOpAmp2 5072 1360 R0
WINDOW 0 -14 2 Left 0
SYMATTR InstName U34
SYMBOL res 5008 1248 R270
WINDOW 0 32 56 VTop 2
WINDOW 3 0 56 VBottom 2
SYMATTR InstName R106
SYMATTR Value 5.86k
SYMBOL res 4912 1280 R270
WINDOW 0 32 56 VTop 2
WINDOW 3 0 56 VBottom 2
SYMATTR InstName R107
SYMATTR Value 10k
SYMBOL res 4848 1360 R90
WINDOW 0 0 56 VBottom 2
WINDOW 3 32 56 VTop 2
SYMATTR InstName R108
SYMATTR Value 10k
SYMBOL res 4976 1360 R90
WINDOW 0 0 56 VBottom 2
WINDOW 3 32 56 VTop 2
SYMATTR InstName R109
SYMATTR Value 10k
SYMBOL cap 4832 1392 R0
SYMATTR InstName C8
SYMATTR Value 0.4µ
SYMBOL cap 4960 1376 R0
SYMATTR InstName C9
SYMATTR Value 0.4µ
SYMBOL OpAmps\\UniversalOpAmp2 5552 1168 R0
WINDOW 0 -14 2 Left 0
SYMATTR InstName U35
SYMBOL res 5328 992 R90
WINDOW 0 0 56 VBottom 2
WINDOW 3 32 56 VTop 2
SYMATTR InstName R110
SYMATTR Value 1k
SYMBOL res 5328 1344 R90
WINDOW 0 0 56 VBottom 2
WINDOW 3 32 56 VTop 2
SYMATTR InstName R111
SYMATTR Value 1k
SYMBOL OpAmps\\UniversalOpAmp2 4544 1056 R0
WINDOW 0 -14 2 Left 0
SYMATTR InstName U36
SYMBOL res 4592 896 R90
WINDOW 0 0 56 VBottom 2
WINDOW 3 32 56 VTop 2
SYMATTR InstName R112
SYMATTR Value 5.86k
SYMBOL res 4496 944 R90
WINDOW 0 0 56 VBottom 2
WINDOW 3 32 56 VTop 2
SYMATTR InstName R113
SYMATTR Value 10k
SYMBOL res 4480 1168 R180
WINDOW 0 36 76 Left 2
WINDOW 3 36 40 Left 2
SYMATTR InstName R114
SYMATTR Value 100k
SYMBOL cap 4352 1056 R90
WINDOW 0 0 32 VBottom 2
WINDOW 3 32 32 VTop 2
SYMATTR InstName C11
SYMATTR Value 4µ
SYMBOL OpAmps\\UniversalOpAmp2 3904 1072 R0
WINDOW 0 -14 2 Left 0
SYMATTR InstName U37
SYMBOL res 3952 912 R90
WINDOW 0 0 56 VBottom 2
WINDOW 3 32 56 VTop 2
SYMATTR InstName R116
SYMATTR Value 100k
SYMBOL res 3856 960 R90
WINDOW 0 0 56 VBottom 2
WINDOW 3 32 56 VTop 2
SYMATTR InstName R117
SYMATTR Value 100
SYMBOL voltage 3712 1072 R0
WINDOW 0 39 81 Left 2
WINDOW 3 24 96 Invisible 2
WINDOW 123 24 44 Left 2
WINDOW 39 0 0 Left 0
SYMATTR InstName INPUT1
SYMATTR Value PWL file="C:\Users\Varad\Downloads\data (1).txt"
SYMBOL OpAmps\\UniversalOpAmp2 6064 1152 R0
WINDOW 0 -14 2 Left 0
SYMATTR InstName U38
SYMBOL res 6000 1040 R270
WINDOW 0 32 56 VTop 2
WINDOW 3 0 56 VBottom 2
SYMATTR InstName R118
SYMATTR Value 5.86k
SYMBOL res 5904 1072 R270
WINDOW 0 32 56 VTop 2
WINDOW 3 0 56 VBottom 2
SYMATTR InstName R119
SYMATTR Value 10k
SYMBOL res 5792 1152 R90
WINDOW 0 0 56 VBottom 2
WINDOW 3 32 56 VTop 2
SYMATTR InstName R120
SYMATTR Value 10k
SYMBOL res 5968 1152 R90
WINDOW 0 0 56 VBottom 2
WINDOW 3 32 56 VTop 2
SYMATTR InstName R121
SYMATTR Value 10k
SYMBOL cap 5808 1184 R0
SYMATTR InstName C12
SYMATTR Value 0.64µ
SYMBOL cap 5952 1168 R0
SYMATTR InstName C13
SYMATTR Value 0.64µ
SYMBOL OpAmps\\UniversalOpAmp2 6224 1152 R0
WINDOW 0 -14 2 Left 0
SYMATTR InstName U39
SYMBOL res 4224 1056 R0
SYMATTR InstName R135
SYMATTR Value 100k
SYMBOL cap 4176 1056 R90
WINDOW 0 0 32 VBottom 2
WINDOW 3 32 32 VTop 2
SYMATTR InstName C10
SYMATTR Value 4µ
SYMBOL voltage -2032 1552 R0
WINDOW 0 39 81 Left 2
WINDOW 3 24 96 Invisible 2
WINDOW 123 24 44 Left 2
WINDOW 39 0 0 Left 0
SYMATTR InstName INPUT3
SYMATTR Value PWL file=C:\Users\Varad\Downloads\sine_wave_with_peaks_5s.txt
SYMBOL bv -1632 2144 R90
WINDOW 0 -32 56 VBottom 2
WINDOW 3 32 56 VTop 2
SYMATTR InstName B1
SYMATTR Value V=WHITE(314*time)*0.1
SYMBOL OpAmps\\UniversalOpAmp2 -1168 2208 R0
WINDOW 0 -14 2 Left 0
SYMATTR InstName U40
SYMBOL res -1232 2208 R90
WINDOW 0 0 56 VBottom 2
WINDOW 3 32 56 VTop 2
SYMATTR InstName R101
SYMATTR Value 1k
SYMBOL cap -1264 2224 R0
SYMATTR InstName C5
SYMATTR Value 10µ
SYMBOL res -1312 2144 R90
WINDOW 0 0 56 VBottom 2
WINDOW 3 32 56 VTop 2
SYMATTR InstName R115
SYMATTR Value 1k
SYMBOL res -1136 2064 R90
WINDOW 0 0 56 VBottom 2
WINDOW 3 32 56 VTop 2
SYMATTR InstName R122
SYMATTR Value 1k
SYMBOL OpAmps\\UniversalOpAmp2 -704 2208 R0
WINDOW 0 -14 2 Left 0
SYMATTR InstName U41
SYMBOL res -768 2208 R90
WINDOW 0 0 56 VBottom 2
WINDOW 3 32 56 VTop 2
SYMATTR InstName R123
SYMATTR Value 1k
SYMBOL cap -800 2224 R0
SYMATTR InstName C14
SYMATTR Value 5µ
SYMBOL res -848 2144 R90
WINDOW 0 0 56 VBottom 2
WINDOW 3 32 56 VTop 2
SYMATTR InstName R124
SYMATTR Value 1k
SYMBOL res -672 2064 R90
WINDOW 0 0 56 VBottom 2
WINDOW 3 32 56 VTop 2
SYMATTR InstName R125
SYMATTR Value 1k
TEXT -2080 1672 Left 2 ;.tran 32
TEXT 0 272 Left 2 !.tran 5.2

The netlist it stands for:
* Median Filter.asc
V1 N004 0 SINE(0 5 50)
L1 N004 P001 1m
C1 N005 P001 10µ
R1 N005 0 2k
L2 N004 P002 1m
C2 N009 P002 10µ
R2 N009 0 3.6k
XU1 N005 N001 VCC -VCC N001 level2 Avol=1Meg GBW=10Meg Slew=10Meg Ilimit=25m Rail=0 Vos=0 En=0 Enk=0 In=0 Ink=0 Rin=500Meg  ; pins In+ In- V+ V- OUT
V2 VCC 0 50
V3 0 -VCC 50
XU2 N009 N008 VCC -VCC N008 level2 Avol=1Meg GBW=10Meg Slew=10Meg Ilimit=25m Rail=0 Vos=0 En=0 Enk=0 In=0 Ink=0 Rin=500Meg  ; pins In+ In- V+ V- OUT
XU3 0 N006 VCC -VCC N002 level2 Avol=1Meg GBW=10Meg Slew=10Meg Ilimit=25m Rail=0 Vos=0 En=0 Enk=0 In=0 Ink=0 Rin=500Meg  ; pins In+ In- V+ V- OUT
R3 N006 N001 3k
R4 N006 N004 3k
R5 N006 N008 3k
R6 N002 N006 1k
XU4 0 N007 VCC -VCC N003 level2 Avol=1Meg GBW=10Meg Slew=10Meg Ilimit=25m Rail=0 Vos=0 En=0 Enk=0 In=0 Ink=0 Rin=500Meg  ; pins In+ In- V+ V- OUT
R7 N007 N002 1k
R8 N003 N007 1k
V5 NC_01 0 SINE(0 5 1 0 0 30)
XU7 N031 N028 VCC -VCC N016 level2 Avol=1Meg GBW=10Meg Slew=10Meg Ilimit=25m Rail=0 Vos=0 En=0 Enk=0 In=0 Ink=0 Rin=500Meg  ; pins In+ In- V+ V- OUT
R18 N028 INPUT2 1k
R19 N016 N028 1k
R20 N031 b 1k
R21 N031 0 1k
XU8 N060 N059 VCC -VCC N048 level2 Avol=1Meg GBW=10Meg Slew=10Meg Ilimit=25m Rail=0 Vos=0 En=0 Enk=0 In=0 Ink=0 Rin=500Meg  ; pins In+ In- V+ V- OUT
R22 N059 b 1k
R23 N048 N059 1k
R24 N060 INPUT2 1k
R25 N060 0 1k
XU9 N016 N022 VCC -VCC N032 level2 Avol=1Meg GBW=10Meg Slew=10Meg Ilimit=25m Rail=0 Vos=0 En=0 Enk=0 In=0 Ink=0 Rin=500Meg  ; pins In+ In- V+ V- OUT
R26 N022 0 10k
D3 N032 N022 D
XU10 N048 N052 VCC -VCC N061 level2 Avol=1Meg GBW=10Meg Slew=10Meg Ilimit=25m Rail=0 Vos=0 En=0 Enk=0 In=0 Ink=0 Rin=500Meg  ; pins In+ In- V+ V- OUT
R27 N052 0 10k
D4 N061 N052 D
R28 N047 N022 10K
R29 N047 N052 10K
XU11 N047 N039 VCC -VCC N046 level2 Avol=1Meg GBW=10Meg Slew=10Meg Ilimit=25m Rail=0 Vos=0 En=0 Enk=0 In=0 Ink=0 Rin=500Meg  ; pins In+ In- V+ V- OUT
R30 N039 0 100
R31 N046 N039 10k
R32 N047 0 100
R9 N050 b 1k
R10 N050 INPUT2 1k
R11 N050 N046 1k
XU5 N050 N040 VCC -VCC N033 level2 Avol=1Meg GBW=10Meg Slew=10Meg Ilimit=25m Rail=0 Vos=0 En=0 Enk=0 In=0 Ink=0 Rin=500Meg  ; pins In+ In- V+ V- OUT
R12 N033 N040 1k
R13 N040 0 2k
XU6 N035 N034 VCC -VCC N023 level2 Avol=1Meg GBW=10Meg Slew=10Meg Ilimit=25m Rail=0 Vos=0 En=0 Enk=0 In=0 Ink=0 Rin=500Meg  ; pins In+ In- V+ V- OUT
R14 N034 N033 1k
R15 N023 N034 1k
R16 N035 c 1k
R17 N035 0 1k
XU12 N063 N062 VCC -VCC N053 level2 Avol=1Meg GBW=10Meg Slew=10Meg Ilimit=25m Rail=0 Vos=0 En=0 Enk=0 In=0 Ink=0 Rin=500Meg  ; pins In+ In- V+ V- OUT
R33 N062 c 1k
R34 N053 N062 1k
R35 N063 N033 1k
R36 N063 0 1k
XU13 N023 N027 VCC -VCC N038 level2 Avol=1Meg GBW=10Meg Slew=10Meg Ilimit=25m Rail=0 Vos=0 En=0 Enk=0 In=0 Ink=0 Rin=500Meg  ; pins In+ In- V+ V- OUT
R37 N027 0 10k
D1 N038 N027 D
XU14 N053 N056 VCC -VCC N064 level2 Avol=1Meg GBW=10Meg Slew=10Meg Ilimit=25m Rail=0 Vos=0 En=0 Enk=0 In=0 Ink=0 Rin=500Meg  ; pins In+ In- V+ V- OUT
R38 N056 0 10k
D2 N064 N056 D
R39 N051 N027 10K
R40 N051 N056 10K
XU15 N051 N041 VCC -VCC N049 level2 Avol=1Meg GBW=10Meg Slew=10Meg Ilimit=25m Rail=0 Vos=0 En=0 Enk=0 In=0 Ink=0 Rin=500Meg  ; pins In+ In- V+ V- OUT
R41 N041 0 100
R42 N049 N041 10k
R43 N051 0 100
R44 N055 c 1k
R45 N055 N033 1k
R46 N055 N049 1k
XU16 N055 N044 VCC -VCC N054 level2 Avol=1Meg GBW=10Meg Slew=10Meg Ilimit=25m Rail=0 Vos=0 En=0 Enk=0 In=0 Ink=0 Rin=500Meg  ; pins In+ In- V+ V- OUT
R47 N054 N044 1k
R48 N044 0 2k
XU17 N084 N082 VCC -VCC N072 level2 Avol=1Meg GBW=10Meg Slew=10Meg Ilimit=25m Rail=0 Vos=0 En=0 Enk=0 In=0 Ink=0 Rin=500Meg  ; pins In+ In- V+ V- OUT
R49 N082 INPUT2 1k
R50 N072 N082 1k
R51 N084 b 1k
R52 N084 0 1k
XU18 N104 N102 VCC -VCC N097 level2 Avol=1Meg GBW=10Meg Slew=10Meg Ilimit=25m Rail=0 Vos=0 En=0 Enk=0 In=0 Ink=0 Rin=500Meg  ; pins In+ In- V+ V- OUT
R53 N102 b 1k
R54 N097 N102 1k
R55 N104 INPUT2 1k
R56 N104 0 1k
XU19 N072 N074 VCC -VCC N085 level2 Avol=1Meg GBW=10Meg Slew=10Meg Ilimit=25m Rail=0 Vos=0 En=0 Enk=0 In=0 Ink=0 Rin=500Meg  ; pins In+ In- V+ V- OUT
R57 N074 0 10k
D5 N085 N074 D
XU20 N097 N099 VCC -VCC N105 level2 Avol=1Meg GBW=10Meg Slew=10Meg Ilimit=25m Rail=0 Vos=0 En=0 Enk=0 In=0 Ink=0 Rin=500Meg  ; pins In+ In- V+ V- OUT
R58 N099 0 10k
D6 N105 N099 D
R59 N096 N074 10K
R60 N096 N099 10K
XU21 N096 N091 VCC -VCC N088 level2 Avol=1Meg GBW=10Meg Slew=10Meg Ilimit=25m Rail=0 Vos=0 En=0 Enk=0 In=0 Ink=0 Rin=500Meg  ; pins In+ In- V+ V- OUT
R61 N091 0 100
R62 N088 N091 10k
R63 N096 0 100
R64 N095 b 3k
R65 N095 INPUT2 3k
XU22 N095 N089 VCC -VCC N077 level2 Avol=1Meg GBW=10Meg Slew=10Meg Ilimit=25m Rail=0 Vos=0 En=0 Enk=0 In=0 Ink=0 Rin=500Meg  ; pins In+ In- V+ V- OUT
R67 N077 N089 1k
R66 N089 N088 2k
R68 N095 0 3k
XU23 N079 N078 VCC -VCC N071 level2 Avol=1Meg GBW=10Meg Slew=10Meg Ilimit=25m Rail=0 Vos=0 En=0 Enk=0 In=0 Ink=0 Rin=500Meg  ; pins In+ In- V+ V- OUT
R69 N078 N077 1k
R70 N071 N078 1k
R71 N079 c 1k
R72 N079 0 1k
XU24 N101 N100 VCC -VCC N094 level2 Avol=1Meg GBW=10Meg Slew=10Meg Ilimit=25m Rail=0 Vos=0 En=0 Enk=0 In=0 Ink=0 Rin=500Meg  ; pins In+ In- V+ V- OUT
R73 N100 c 1k
R74 N094 N100 1k
R75 N101 N077 1k
R76 N101 0 1k
XU25 N071 N073 VCC -VCC N083 level2 Avol=1Meg GBW=10Meg Slew=10Meg Ilimit=25m Rail=0 Vos=0 En=0 Enk=0 In=0 Ink=0 Rin=500Meg  ; pins In+ In- V+ V- OUT
R77 N073 0 10k
D7 N083 N073 D
XU26 N094 N098 VCC -VCC N103 level2 Avol=1Meg GBW=10Meg Slew=10Meg Ilimit=25m Rail=0 Vos=0 En=0 Enk=0 In=0 Ink=0 Rin=500Meg  ; pins In+ In- V+ V- OUT
R78 N098 0 10k
D8 N103 N098 D
R79 N093 N073 10K
R80 N093 N098 10K
XU27 N093 N090 VCC -VCC N086 level2 Avol=1Meg GBW=10Meg Slew=10Meg Ilimit=25m Rail=0 Vos=0 En=0 Enk=0 In=0 Ink=0 Rin=500Meg  ; pins In+ In- V+ V- OUT
R81 N090 0 100
R82 N086 N090 10k
R83 N093 0 100
R84 N092 c 3k
R85 N092 N077 3k
XU28 N092 N087 VCC -VCC N067 level2 Avol=1Meg GBW=10Meg Slew=10Meg Ilimit=25m Rail=0 Vos=0 En=0 Enk=0 In=0 Ink=0 Rin=500Meg  ; pins In+ In- V+ V- OUT
R86 N067 N087 1k
R87 N087 N086 2k
R88 N092 0 3k
V6 NC_02 0 SINE(0 5 1 0 0 -30)
XU29 N069 N065 VCC -VCC MEDIAN level2 Avol=1Meg GBW=10Meg Slew=10Meg Ilimit=25m Rail=0 Vos=0 En=0 Enk=0 In=0 Ink=0 Rin=500Meg  ; pins In+ In- V+ V- OUT
R89 MEDIAN N065 1k
R90 N065 N054 1k
R91 N065 N067 1k
R92 0 N069 1k
R93 N069 N068 2k
XU30 N107 N106 VCC -VCC N068 level2 Avol=1Meg GBW=10Meg Slew=10Meg Ilimit=25m Rail=0 Vos=0 En=0 Enk=0 In=0 Ink=0 Rin=500Meg  ; pins In+ In- V+ V- OUT
R94 N107 b 1k
R95 N107 INPUT2 1k
R96 N107 c 1k
R97 N068 N106 2k
R98 N106 0 1k
L3 N057 P003 1m
C3 N058 P003 10µ
R99 N058 0 10k
L4 N057 P004 1m
C4 N070 P004 10µ
R100 N070 0 179k
XU31 N058 N045 VCC -VCC N045 level2 Avol=1Meg GBW=10Meg Slew=10Meg Ilimit=25m Rail=0 Vos=0 En=0 Enk=0 In=0 Ink=0 Rin=500Meg  ; pins In+ In- V+ V- OUT
XU32 N070 N066 VCC -VCC N066 level2 Avol=1Meg GBW=10Meg Slew=10Meg Ilimit=25m Rail=0 Vos=0 En=0 Enk=0 In=0 Ink=0 Rin=500Meg  ; pins In+ In- V+ V- OUT
XU33 N018 N010 VCC -VCC N011 level2 Avol=1Meg GBW=10Meg Slew=10Meg Ilimit=25m Rail=0 Vos=0 En=0 Enk=0 In=0 Ink=0 Rin=500Meg  ; pins In+ In- V+ V- OUT
R102 N010 N011 5.86k
R103 0 N010 10k
R104 N017 N011 10k
R105 N018 0 10k
C6 N018 N017 0.1µ
C7 N017 N013 0.1µ
XU34 N043 N036 VCC -VCC N037 level2 Avol=1Meg GBW=10Meg Slew=10Meg Ilimit=25m Rail=0 Vos=0 En=0 Enk=0 In=0 Ink=0 Rin=500Meg  ; pins In+ In- V+ V- OUT
R106 N036 N037 5.86k
R107 0 N036 10k
R108 N042 N013 10k
R109 N043 N042 10k
C8 N042 N037 0.4µ
C9 N043 0 0.4µ
XU35 N015 N019 VCC -VCC N019 level2 Avol=1Meg GBW=10Meg Slew=10Meg Ilimit=25m Rail=0 Vos=0 En=0 Enk=0 In=0 Ink=0 Rin=500Meg  ; pins In+ In- V+ V- OUT
R110 N015 N011 1k
R111 N015 N037 1k
XU36 N025 N012 VCC -VCC N013 level2 Avol=1Meg GBW=10Meg Slew=10Meg Ilimit=25m Rail=0 Vos=0 En=0 Enk=0 In=0 Ink=0 Rin=500Meg  ; pins In+ In- V+ V- OUT
R112 N013 N012 5.86k
R113 N012 0 10k
R114 0 N025 100k
C11 N025 N024 4µ
XU37 N026 N014 VCC -VCC INPUT1 level2 Avol=1Meg GBW=10Meg Slew=10Meg Ilimit=25m Rail=0 Vos=0 En=0 Enk=0 In=0 Ink=0 Rin=500Meg  ; pins In+ In- V+ V- OUT
R116 INPUT1 N014 100k
R117 N014 0 100
V§INPUT1 N026 0 PWL file="C:\Users\Varad\Downloads\data (1).txt"
XU38 N030 N020 VCC -VCC N021 level2 Avol=1Meg GBW=10Meg Slew=10Meg Ilimit=25m Rail=0 Vos=0 En=0 Enk=0 In=0 Ink=0 Rin=500Meg  ; pins In+ In- V+ V- OUT
R118 N020 N021 5.86k
R119 0 N020 10k
R120 N029 N019 10k
R121 N030 N029 10k
C12 N029 N021 0.64µ
C13 N030 0 0.64µ
XU39 N021 OUTPUT VCC -VCC OUTPUT level2 Avol=1Meg GBW=10Meg Slew=10Meg Ilimit=25m Rail=0 Vos=0 En=0 Enk=0 In=0 Ink=0 Rin=500Meg  ; pins In+ In- V+ V- OUT
R135 N024 N013 100k
C10 N024 INPUT1 4µ
V§INPUT3 N057 0 PWL file=C:\Users\Varad\Downloads\sine_wave_with_peaks_5s.txt
B1 INPUT2 INPUT1 V=WHITE(314*time)*0.1
XU40 N080 N075 VCC -VCC b level2 Avol=1Meg GBW=10Meg Slew=10Meg Ilimit=25m Rail=0 Vos=0 En=0 Enk=0 In=0 Ink=0 Rin=500Meg  ; pins In+ In- V+ V- OUT
R101 N080 INPUT2 1k
C5 N080 0 10µ
R115 N075 INPUT2 1k
R122 b N075 1k
XU41 N081 N076 VCC -VCC c level2 Avol=1Meg GBW=10Meg Slew=10Meg Ilimit=25m Rail=0 Vos=0 En=0 Enk=0 In=0 Ink=0 Rin=500Meg  ; pins In+ In- V+ V- OUT
R123 N081 INPUT2 1k
C14 N081 0 5µ
R124 N076 INPUT2 1k
R125 c N076 1k
.model D D
.lib standard.dio
* .tran 32
.tran 5.2
.lib UniversalOpAmp2.lib
.backanno
.end